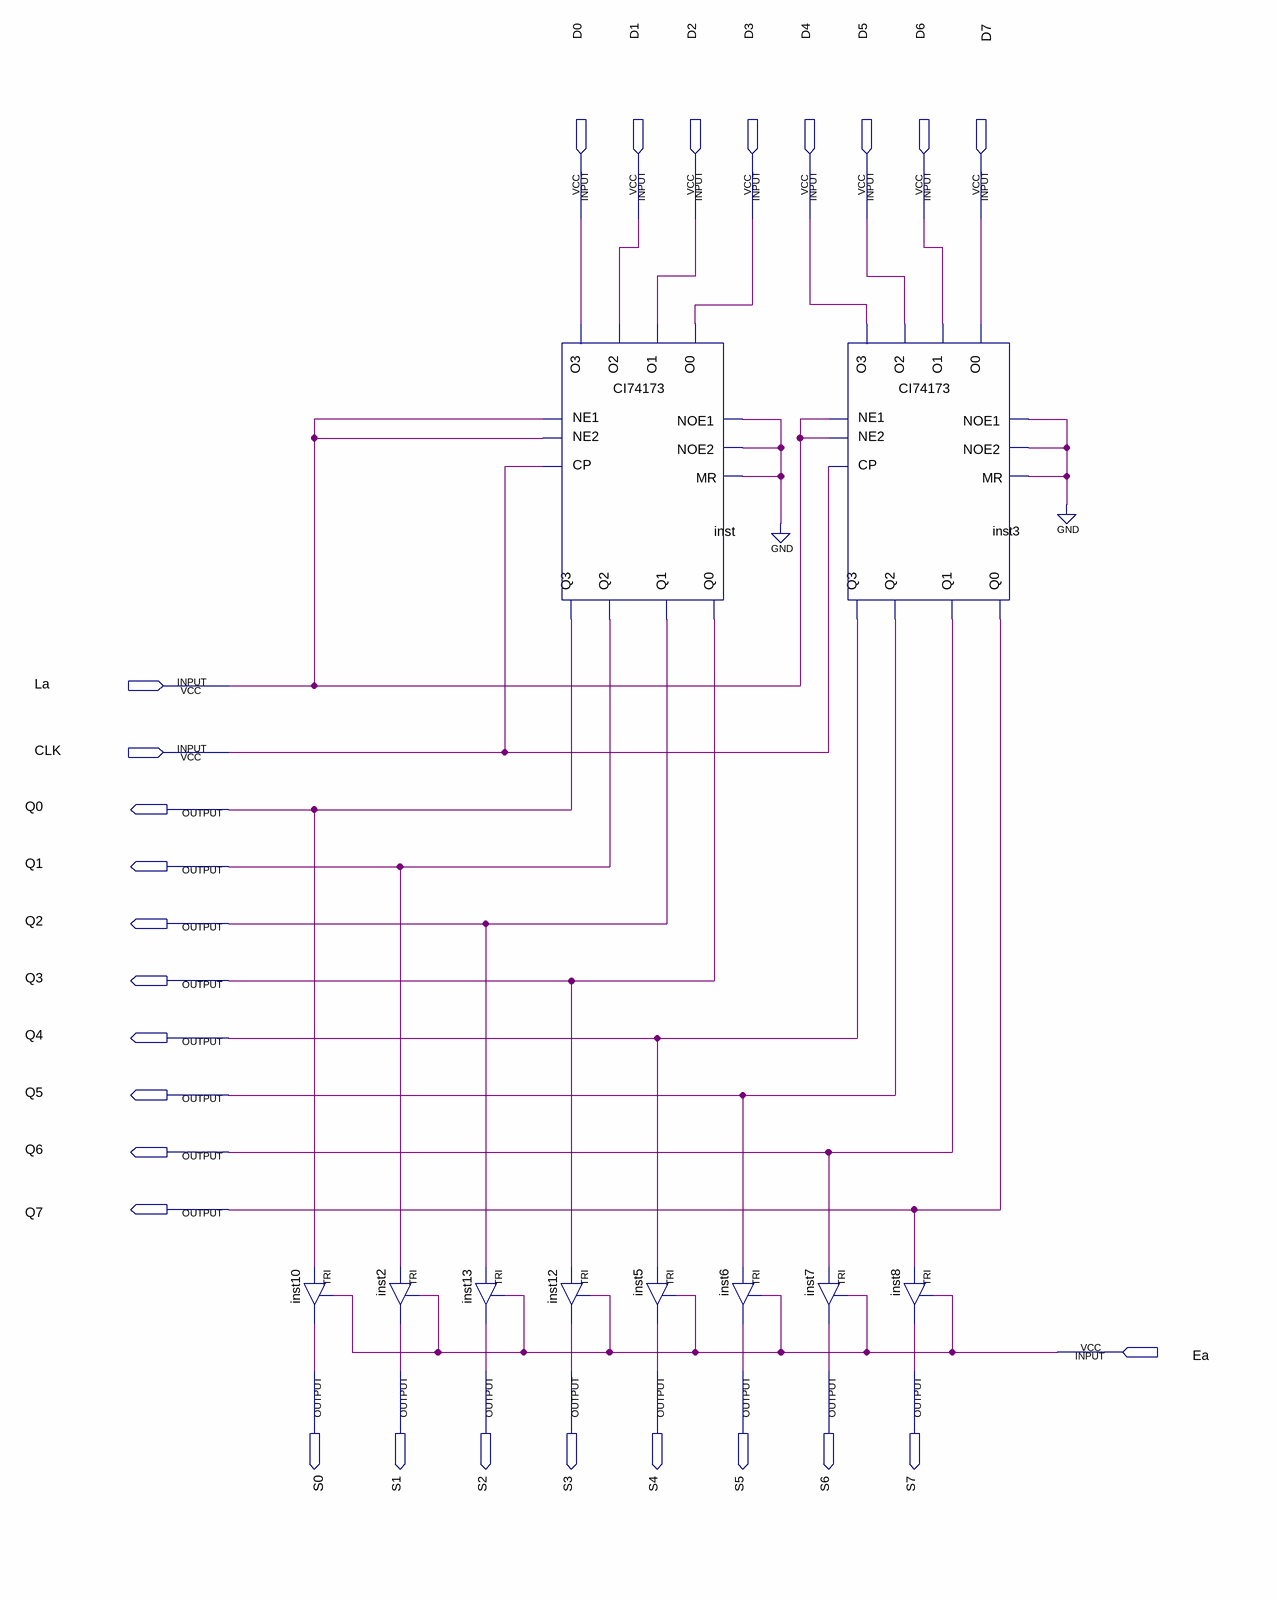
[diagram p0: schematic sheet]
// Quartus schematic acumulador.bdf as structural Verilog: 10 symbols, 27 pins
module acumulador (
  input  D0,
  input  D1,
  input  D2,
  input  D3,
  input  D4,
  input  D5,
  input  D6,
  input  D7,
  input  La,
  input  CLK,
  input  Ea,
  output Q0,
  output Q1,
  output Q2,
  output Q3,
  output Q4,
  output Q5,
  output Q6,
  output Q7,
  output S0,
  output S1,
  output S2,
  output S3,
  output S4,
  output S5,
  output S6,
  output S7
);

  TRI inst10 (.IN(Q0), .OE(Ea), .OUT(S0));
  TRI inst2 (.IN(Q1), .OE(Ea), .OUT(S1));
  TRI inst13 (.IN(Q2), .OE(Ea), .OUT(S2));
  CI74173 inst (
    .O0(D3), .O1(D2), .O2(D1), .O3(D0), .NE1(La), .NE2(La), .CP(CLK), .MR(1'b0), .NOE1(1'b0), .NOE2(1'b0),
    .Q1(Q2), .Q2(Q1), .Q3(Q0), .Q0(Q3));
  TRI inst12 (.IN(Q3), .OE(Ea), .OUT(S3));
  TRI inst5 (.IN(Q4), .OE(Ea), .OUT(S4));
  TRI inst6 (.IN(Q5), .OE(Ea), .OUT(S5));
  CI74173 inst3 (
    .O0(D7), .O1(D6), .O2(D5), .O3(D4), .NE1(La), .NE2(La), .CP(CLK), .MR(1'b0), .NOE1(1'b0), .NOE2(1'b0),
    .Q1(Q6), .Q2(Q5), .Q3(Q4), .Q0(Q7));
  TRI inst7 (.IN(Q6), .OE(Ea), .OUT(S6));
  TRI inst8 (.IN(Q7), .OE(Ea), .OUT(S7));
endmodule
